# Altium schematic sheet 07_LMS7002M_Power.SchDoc: LMS7002M power
size A3; Organization: Lime Microsystems; Address1: Surrey Tech Centre; Address2: Guildford GU2 7YG; Address3: Surrey; Address4: United Kingdom; SheetNumber: 7
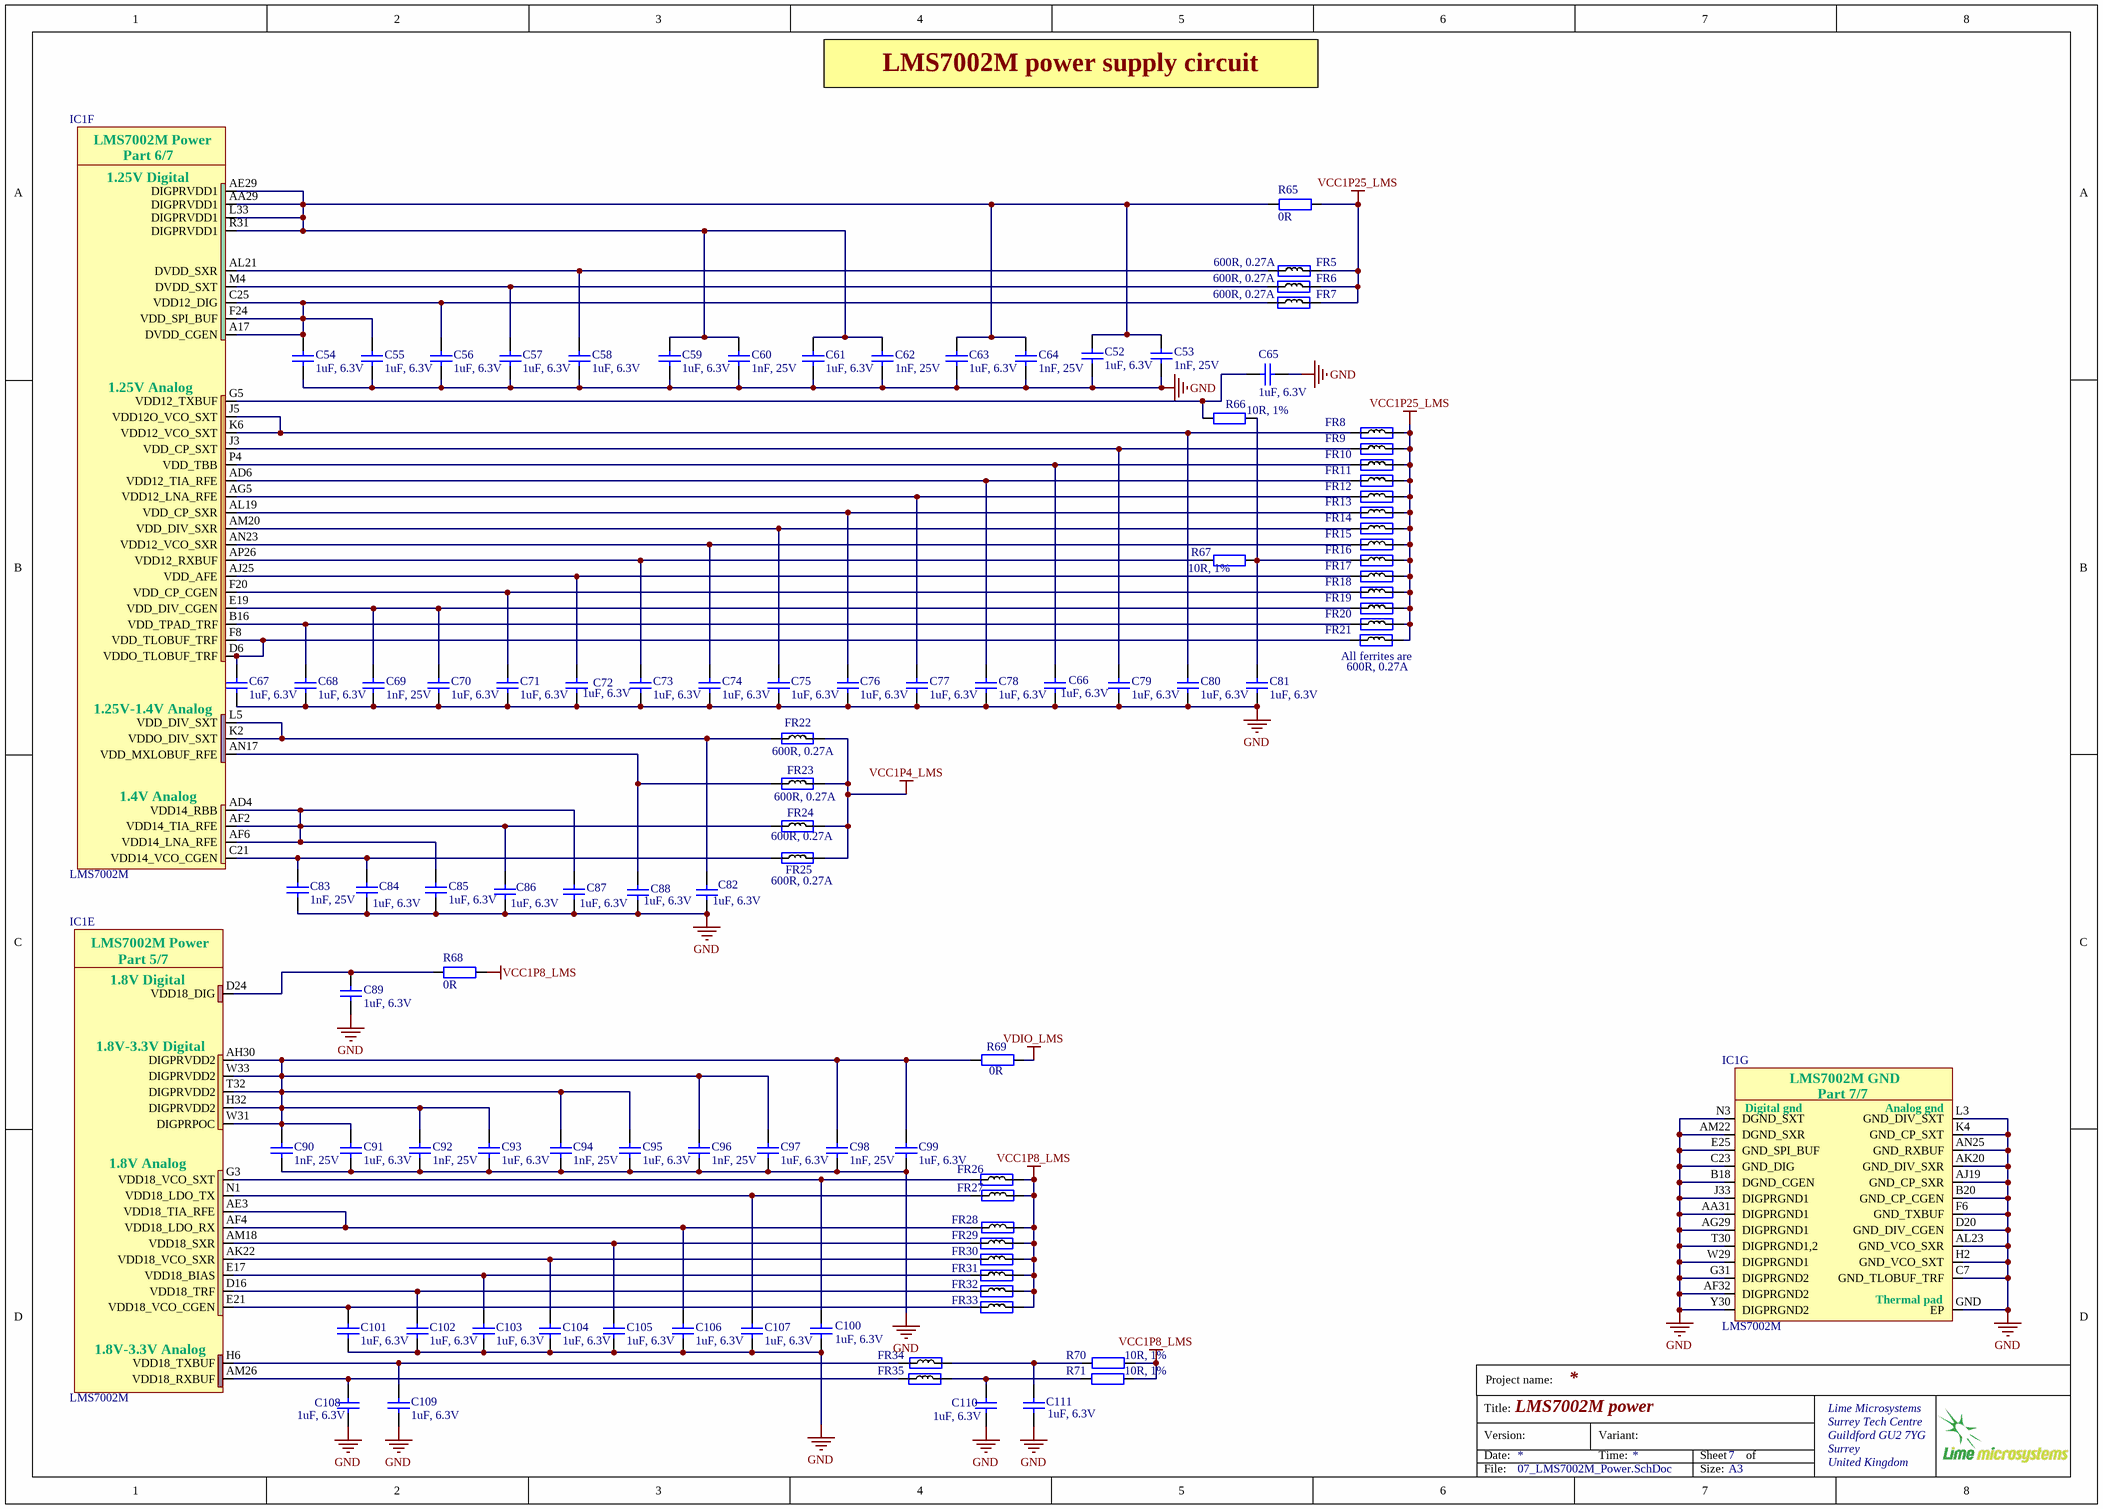
[diagram p0: 07_LMS7002M_Power.SchDoc]

## Parts
C52  1uF, 6.3V  [CAP0201]
C53  1nF, 25V  [CAP0201]
C54  1uF, 6.3V  [CAP0201]
C55  1uF, 6.3V  [CAP0201]
C56  1uF, 6.3V  [CAP0201]
C57  1uF, 6.3V  [CAP0201]
C58  1uF, 6.3V  [CAP0201]
C59  1uF, 6.3V  [CAP0201]
C60  1nF, 25V  [CAP0201]
C61  1uF, 6.3V  [CAP0201]
C62  1nF, 25V  [CAP0201]
C63  1uF, 6.3V  [CAP0201]
C64  1nF, 25V  [CAP0201]
C65  1uF, 6.3V  [CAP0201]
C66  1uF, 6.3V  [CAP0201]
C67  1uF, 6.3V  [CAP0201]
C68  1uF, 6.3V  [CAP0201]
C69  1nF, 25V  [CAP0201]
C70  1uF, 6.3V  [CAP0201]
C71  1uF, 6.3V  [CAP0201]
C72  1uF, 6.3V  [CAP0201]
C73  1uF, 6.3V  [CAP0201]
C74  1uF, 6.3V  [CAP0201]
C75  1uF, 6.3V  [CAP0201]
C76  1uF, 6.3V  [CAP0201]
C77  1uF, 6.3V  [CAP0201]
C78  1uF, 6.3V  [CAP0201]
C79  1uF, 6.3V  [CAP0201]
C80  1uF, 6.3V  [CAP0201]
C81  1uF, 6.3V  [CAP0201]
C82  1uF, 6.3V  [CAP0201]
C83  1nF, 25V  [CAP0201]
C84  1uF, 6.3V  [CAP0201]
C85  1uF, 6.3V  [CAP0201]
C86  1uF, 6.3V  [CAP0201]
C87  1uF, 6.3V  [CAP0201]
C88  1uF, 6.3V  [CAP0201]
C89  1uF, 6.3V  [CAP0201]
C90  1nF, 25V  [CAP0201]
C91  1uF, 6.3V  [CAP0201]
C92  1nF, 25V  [CAP0201]
C93  1uF, 6.3V  [CAP0201]
C94  1nF, 25V  [CAP0201]
C95  1uF, 6.3V  [CAP0201]
C96  1nF, 25V  [CAP0201]
C97  1uF, 6.3V  [CAP0201]
C98  1nF, 25V  [CAP0201]
C99  1uF, 6.3V  [CAP0201]
C100  1uF, 6.3V  [CAP0201]
C101  1uF, 6.3V  [CAP0201]
C102  1uF, 6.3V  [CAP0201]
C103  1uF, 6.3V  [CAP0201]
C104  1uF, 6.3V  [CAP0201]
C105  1uF, 6.3V  [CAP0201]
C106  1uF, 6.3V  [CAP0201]
C107  1uF, 6.3V  [CAP0201]
C108  1uF, 6.3V  [CAP0201]
C109  1uF, 6.3V  [CAP0201]
C110  1uF, 6.3V  [CAP0201]
C111  1uF, 6.3V  [CAP0201]
FR5  600R, 0.27A  [RES0201]
FR6  600R, 0.27A  [RES0201]
FR7  600R, 0.27A  [RES0201]
FR8  600R, 0.27A  [RES0201]
FR9  600R, 0.27A  [RES0201]  (value not drawn)
FR10  600R, 0.27A  [RES0201]  (value not drawn)
FR11  600R, 0.27A  [RES0201]  (value not drawn)
FR12  600R, 0.27A  [RES0201]  (value not drawn)
FR13  600R, 0.27A  [RES0201]  (value not drawn)
FR14  600R, 0.27A  [RES0201]  (value not drawn)
FR15  600R, 0.27A  [RES0201]  (value not drawn)
FR16  600R, 0.27A  [RES0201]  (value not drawn)
FR17  600R, 0.27A  [RES0201]  (value not drawn)
FR18  600R, 0.27A  [RES0201]  (value not drawn)
FR19  600R, 0.27A  [RES0201]  (value not drawn)
FR20  600R, 0.27A  [RES0201]  (value not drawn)
FR21  600R, 0.27A  [RES0201]  (value not drawn)
FR22  600R, 0.27A  [RES0201]
FR23  600R, 0.27A  [RES0201]
FR24  600R, 0.27A  [RES0201]
FR25  600R, 0.27A  [RES0201]
FR26  600R, 0.27A  [RES0201]  (value not drawn)
FR27  600R, 0.27A  [RES0201]  (value not drawn)
FR28  600R, 0.27A  [RES0201]  (value not drawn)
FR29  600R, 0.27A  [RES0201]  (value not drawn)
FR30  600R, 0.27A  [RES0201]  (value not drawn)
FR31  600R, 0.27A  [RES0201]  (value not drawn)
FR32  600R, 0.27A  [RES0201]  (value not drawn)
FR33  600R, 0.27A  [RES0201]  (value not drawn)
FR34  600R, 0.27A  [RES0201]  (value not drawn)
FR35  600R, 0.27A  [RES0201]  (value not drawn)
IC1  LMS7002M  [LMS7002M_v5_LESS_SILK]  (parts E,F,G of 7)
R65  0R  [RES0402]
R66  10R, 1%  [RES0201]
R67  10R, 1%  [RES0201]
R68  0R  [RES0201]
R69  0R  [RES0402]
R70  10R, 1%  [RES0201]
R71  10R, 1%  [RES0201]

## Nets
GND: C52.2 C53.2 C54.2 C55.2 C56.2 C57.1 C58.2 C59.2 C60.2 C61.2 C62.2 C63.2 C64.2 C65.2 C66.2 C67.2 C68.2 C69.2 C70.2 C71.1 C72.2 C73.2 C74.2 C75.2 C76.2 C77.2 C78.1 C79.2 C80.1 C81.1 C82.2 C83.2 C84.2 C85.2 C86.2 C87.2 C88.2 C89.2 C90.2 C91.2 C92.2 C93.2 C94.2 C95.2 C96.2 C97.2 C98.2 C99.2 C100.2 C101.2 C102.2 C103.2 C104.2 C105.2 C106.2 C107.2 C108.2 C109.2 C110.2 C111.2 IC1.AA31(DIGPRGND1) IC1.AF32(DIGPRGND2) IC1.AG29(DIGPRGND1) IC1.AJ19(GND_CP_SXR) IC1.AK20(GND_DIV_SXR) IC1.AL23(GND_VCO_SXR) IC1.AM22(DGND_SXR) IC1.AN25(GND_RXBUF) IC1.B18(DGND_CGEN) IC1.B20(GND_CP_CGEN) IC1.C7(GND_TLOBUF_TRF) IC1.C23(GND_DIG) IC1.D20(GND_DIV_CGEN) IC1.E25(GND_SPI_BUF) IC1.F6(GND_TXBUF) IC1.G31(DIGPRGND2) IC1.GND(EP) IC1.H2(GND_VCO_SXT) IC1.J33(DIGPRGND1) IC1.K4(GND_CP_SXT) IC1.L3(GND_DIV_SXT) IC1.N3(DGND_SXT) IC1.T30(DIGPRGND1,2) IC1.W29(DIGPRGND1) IC1.Y30(DIGPRGND2)
VCC1P4_LMS: FR22.2 FR23.2 FR24.2 FR25.2
VCC1P8_LMS: FR26.2 FR27.1 FR28.1 FR29.2 FR30.2 FR31.2 FR32.2 FR33.2 R68.2 R70.2 R71.1
VCC1P25_LMS: FR5.2 FR6.2 FR7.2 FR8.2 FR9.2 FR10.2 FR11.2 FR12.2 FR13.2 FR14.2 FR15.2 FR16.2 FR17.2 FR18.2 FR19.2 FR20.2 FR21.2 R65.1
VDIO_LMS: R69.1
NetC52_1: C52.1 C53.1 C59.1 C60.1 C61.1 C62.1 C63.1 C64.1 IC1.AA29(DIGPRVDD1) IC1.AE29(DIGPRVDD1) IC1.L33(DIGPRVDD1) IC1.R31(DIGPRVDD1) R65.2
NetC54_1: C54.1 C55.1 C56.1 FR7.1 IC1.A17(DVDD_CGEN) IC1.C25(VDD12_DIG) IC1.F24(VDD_SPI_BUF)
NetC57_2: C57.2 FR6.1 IC1.M4(DVDD_SXT)
NetC58_1: C58.1 FR5.1 IC1.AL21(DVDD_SXR)
NetC65_1: C65.1 IC1.G5(VDD12_TXBUF) R66.1
NetC66_1: C66.1 FR10.1 IC1.P4(VDD_TBB)
NetC67_1: C67.1 FR21.1 IC1.D6(VDDO_TLOBUF_TRF) IC1.F8(VDD_TLOBUF_TRF)
NetC68_1: C68.1 FR20.1 IC1.B16(VDD_TPAD_TRF)
NetC69_1: C69.1 C70.1 FR19.1 IC1.E19(VDD_DIV_CGEN)
NetC71_2: C71.2 FR18.1 IC1.F20(VDD_CP_CGEN)
NetC72_1: C72.1 FR17.1 IC1.AJ25(VDD_AFE)
NetC73_1: C73.1 IC1.AP26(VDD12_RXBUF) R67.1
NetC74_1: C74.1 FR15.1 IC1.AN23(VDD12_VCO_SXR)
NetC75_1: C75.1 FR14.1 IC1.AM20(VDD_DIV_SXR)
NetC76_1: C76.1 FR13.1 IC1.AL19(VDD_CP_SXR)
NetC77_1: C77.1 FR12.1 IC1.AG5(VDD12_LNA_RFE)
NetC78_2: C78.2 FR11.1 IC1.AD6(VDD12_TIA_RFE)
NetC79_1: C79.1 FR9.1 IC1.J3(VDD_CP_SXT)
NetC80_2: C80.2 FR8.1 IC1.J5(VDD12O_VCO_SXT) IC1.K6(VDD12_VCO_SXT)
NetC81_2: C81.2 FR16.1 R66.2 R67.2
NetC82_1: C82.1 FR22.1 IC1.K2(VDDO_DIV_SXT) IC1.L5(VDD_DIV_SXT)
NetC83_1: C83.1 C84.1 FR25.1 IC1.C21(VDD14_VCO_CGEN)
NetC85_1: C85.1 C86.1 C87.1 FR24.1 IC1.AD4(VDD14_RBB) IC1.AF2(VDD14_TIA_RFE) IC1.AF6(VDD14_LNA_RFE)
NetC88_1: C88.1 FR23.1 IC1.AN17(VDD_MXLOBUF_RFE)
NetC89_1: C89.1 IC1.D24(VDD18_DIG) R68.1
NetC90_1: C90.1 C91.1 C92.1 C93.1 C94.1 C95.1 C96.1 C97.1 C98.1 C99.1 IC1.AH30(DIGPRVDD2) IC1.H32(DIGPRVDD2) IC1.T32(DIGPRVDD2) IC1.W31(DIGPRPOC) IC1.W33(DIGPRVDD2) R69.2
NetC100_1: C100.1 FR26.1 IC1.G3(VDD18_VCO_SXT)
NetC101_1: C101.1 FR33.1 IC1.E21(VDD18_VCO_CGEN)
NetC102_1: C102.1 FR32.1 IC1.D16(VDD18_TRF)
NetC103_1: C103.1 FR31.1 IC1.E17(VDD18_BIAS)
NetC104_1: C104.1 FR30.1 IC1.AK22(VDD18_VCO_SXR)
NetC105_1: C105.1 FR29.1 IC1.AM18(VDD18_SXR)
NetC106_1: C106.1 FR28.2 IC1.AE3(VDD18_TIA_RFE) IC1.AF4(VDD18_LDO_RX)
NetC107_1: C107.1 FR27.2 IC1.N1(VDD18_LDO_TX)
NetC108_1: C108.1 FR35.1 IC1.AM26(VDD18_RXBUF)
NetC109_1: C109.1 FR34.2 IC1.H6(VDD18_TXBUF)
NetC110_1: C110.1 FR35.2 R71.2
NetC111_1: C111.1 FR34.1 R70.1

## Notes on the sheet
- LMS7002M power supply circuit
- (near FR21) All ferrites are
- Project name:
- Title:
- Version:
- Date:
- Variant:
- Time:
- Sheet
- of
- File:
- Size:
- A3
- (in symbol LMS7002Mr4, part E) LMS7002M Power; Part 5/7; 1.8V Digital; 1.8V-3.3V Digital; 1.8V Analog; 1.8V-3.3V Analog
- (in symbol LMS7002Mr4, part F) LMS7002M Power; Part 6/7; 1.25V Digital; 1.25V Analog; 1.25V-1.4V Analog; 1.4V Analog
- (in symbol LMS7002Mr4, part G) LMS7002M GND; Part 7/7; Digital gnd; Analog gnd; Thermal pad

## Library data of the parts
C52 C54-C59 C61 C63 C65-C68 C70-C82 C84-C89 C91 C93 C95 C97 C99-C111 = Cap_0402: Manufacturer: TDK Corporation; Manufacturer Part Number 1: JMK063ABJ105MP-F; Part Description: 1µF ±20% 6.3V X5R Ceramic Capacitor -55°C ~ 85°C Surface Mount, MLCC 0201 (0603 Metric) 0.024" L x 0.012" W (0.60mm x 0.30mm); Value: 1uF, 20%; Tolerance: ±20%; Capacitance: 1.0µF; Temperature Coefficient: X5R; Supplier 1: Digi-Key; Supplier Part Number 1: 587-5864-2-ND; Applications: General Purpose; Features: -; Lead Style: -; Ratings: -; Thickness (Max): -; Lead Spacing: -; Height - Seated (Max): -; Size / Dimension: 0.024" L x 0.012" W (0.60mm x 0.30mm); Mounting Type: Surface Mount, MLCC; Operating Temperature: -55°C ~ 85°C; Package / Case: 0201 (0603 Metric); Packaging: Cut Tape (CT); Voltage - Rated: 6.3V; Category: Capacitors; RoHS: RoHS Compliant
C53 C60 C62 C64 C69 C83 C90 C92 C94 C96 C98 = Cap_0402: Manufacturer Part Number 1: C0603X7R1E102K030BA; Manufacturer: TDK Corporation; Part Description: 1000pF ±10% 25V X7R Ceramic Capacitor -55°C ~ 125°C Surface Mount, MLCC 0201 (0603 Metric) 0.024" L x 0.012" W (0.60mm x 0.30mm); Temperature Coefficient: X7R; Tolerance: ±10%; Capacitance: 1000pF; Value: 1nF, 25V; Supplier 1: Digi-Key; Supplier Part Number 1: 445-7275-1-ND; Voltage - Rated: 25V; Features: -; Package / Case: 0201 (0603 Metric); Lead Spacing: -; Mounting Type: Surface Mount, MLCC; Lead Style: -; Height - Seated (Max): -; Operating Temperature: -55°C ~ 125°C; Size / Dimension: 0.024" L x 0.012" W (0.60mm x 0.30mm); Applications: General Purpose; Ratings: -; Thickness (Max): 0.013" (0.33mm); RoHS: RoHS Compliant; Packaging: Cut Tape (CT); Category: Capacitors
FR5-FR35 = Ferrite: Manufacturer Part Number 1: BK0603TS601-T; Manufacturer: Taiyo Yuden; Part Description: FERRITE BEAD 600 OHM 0201 1LN; DC Resistance (DCR): 750 mOhm Max; Filter Type: Differential Mode - Single; Impedance @ Frequency: 600 Ohm @ 100MHz; Current Rating: 270mA; Value: 600R@100MHz; Supplier 1: Digi-Key; Supplier Part Number 1: 587-3277-1-ND; Size / Dimension: 0.024" L x 0.012" W (0.60mm x 0.30mm); Package / Case: 0201 (0603 Metric); Height (Max): 0.013" (0.33mm); Mounting Type: Surface Mount; Packaging: Cut Tape (CT); RoHS: RoHS Compliant; Category: Filters
IC1 = LMS7002Mr4: Schematic symbol revision 4. Default footprint - 0.31mm pad; Manufacturer: Lime Microsystems; Part Description: IC FPRF Transceiver LMS7002M; 261 pin aQFN; Supplier 1: Lime Microsystems; Supplier Part Number 1: LMS7002M; Manufacturer Part Number 1: LMS7002M
R65 R69 = Res_0402: Manufacturer Part Number 1: RC0402JR-070RL; Manufacturer: Yageo; Part Description: RES SMD 0.0OHM JUMPER 1/16W 0402; Resistance (Ohms): 0.0; Tolerance: Jumper; Power (Watts): 0.063W, 1/16W; Value: 0R; Supplier 1: Digi-Key; Supplier Part Number 1: 311-0.0JRTR-ND; Category: Resistors; Temperature Coefficient: -; Features: Moisture Resistant; Supplier Device Package: 0402; Height: 0.016" (0.40mm); Package / Case: 0402 (1005 Metric); Operating Temperature: -55°C ~ 155°C; Size / Dimension: 0.039" L x 0.020" W (1.00mm x 0.50mm); Composition: Thick Film; Packaging: Tape & Reel (TR); Number of Terminations: 2; RoHS: RoHS Compliant
R66 R67 R70 R71 = Res_0402: Manufacturer: Panasonic Electronic Components; Part Description: RES SMD 10 OHM 1% 1/20W 0201; Manufacturer Part Number 1: ERJ-1GEF10R0C; Power (Watts): 0.05W, 1/20W; Resistance (Ohms): 10; Temperature Coefficient: ±200ppm/°C; Value: 10R, 1%; Supplier 1: Digi-Key; Supplier Part Number 1: P10.0ABCT-ND; Package / Case: 0201 (0603 Metric); Height: 0.010" (0.26mm); Supplier Device Package: 0201; Packaging: Cut Tape (CT); Composition: Thick Film; Category: Resistors; Tolerance: ±1%; Number of Terminations: 2; Size / Dimension: 0.024" L x 0.012" W (0.60mm x 0.30mm); Operating Temperature: -55°C ~ 125°C; Features: -; RoHS: RoHS Compliant
R68 = Res_0402: Manufacturer: Yageo; Part Description: 0 Ohms Jumper Chip Resistor 0201 (0603 Metric) Moisture Resistant Thick Film; Manufacturer Part Number 1: RC0201JR-070RL; Tolerance: 5%; Max Power Dissipation: 50mW; Voltage Rating (DC): 25V; Value: 0R; Supplier 1: Digi-Key; Supplier Part Number 1: 311-0.0NCT-ND; Number of Terminations: 2; Height: 0.01inch; Features: Moisture Resistant; RoHS: Yes; Packaging: Tape and Reel; Case/Package: 0201; Case Code (Imperial): 0201; Case Code (Metric): 0603; ComponentLink1Description: http://www.yageo.com/documents/recent/PYu-RC_Group_51_RoHS_L_7.pdf; ComponentLink1URL: http://www.yageo.com/documents/recent/PYu-RC_Group_51_RoHS_L_7.pdf; ComponentLink2Description: https://datasheet.ciiva.com/7672/1563626-7672248.pdf?src-supplier=Element14; ComponentLink2URL: https://datasheet.ciiva.com/7672/1563626-7672248.pdf?src-supplier=Element14; ComponentLink3Description: https://datasheet.ciiva.com/7672/1563626-7672247.pdf?src-supplier=Element14; ComponentLink3URL: https://datasheet.ciiva.com/7672/1563626-7672247.pdf?src-supplier=Element14; ComponentLink4Description: https://datasheet.ciiva.com/7660/1421516-7660808.pdf?src-supplier=Element14; ComponentLink4URL: https://datasheet.ciiva.com/7660/1421516-7660808.pdf?src-supplier=Element14; ComponentLink5Description: https://datasheet.ciiva.com/46391/1421516-46391340.pdf?src-supplier=Element14; ComponentLink5URL: https://datasheet.ciiva.com/46391/1421516-46391340.pdf?src-supplier=Element14; Construction: Rectangular; Contact Plating: Tin,Matte; Depth: 0.3mm; Lead Free: Lead Free; Length: 0.024inch; Max Operating Temperature: 125°C; Military Standard: Not; Min Operating Temperature: -55°C; Package Quantity: 1; Power Rating: 50mW; Pricing 1: 1=0,10000, 10=0,03700, 25=0,02680, 50=0,02020, 100=0,01500, 250=0,01140, 500=0,00912, 1000=0,00672, 5000=0,00482 (USD); Radiation Hardening: No; Resistance: 0R; Resistance Tolerance: 5%; Resistor Type: Thick Film; RoHS Compliant: Yes; Series: RC; Size Code: 0201; Stock 1: 6252381; Termination: SMD/SMT; Voltage Rating: 25V; Weight: 6E-06oz; Width: 0.012inch